# Altium schematic sheet 02 BLOCK DIAGRAM.SchDoc
size 513 x 386 mm
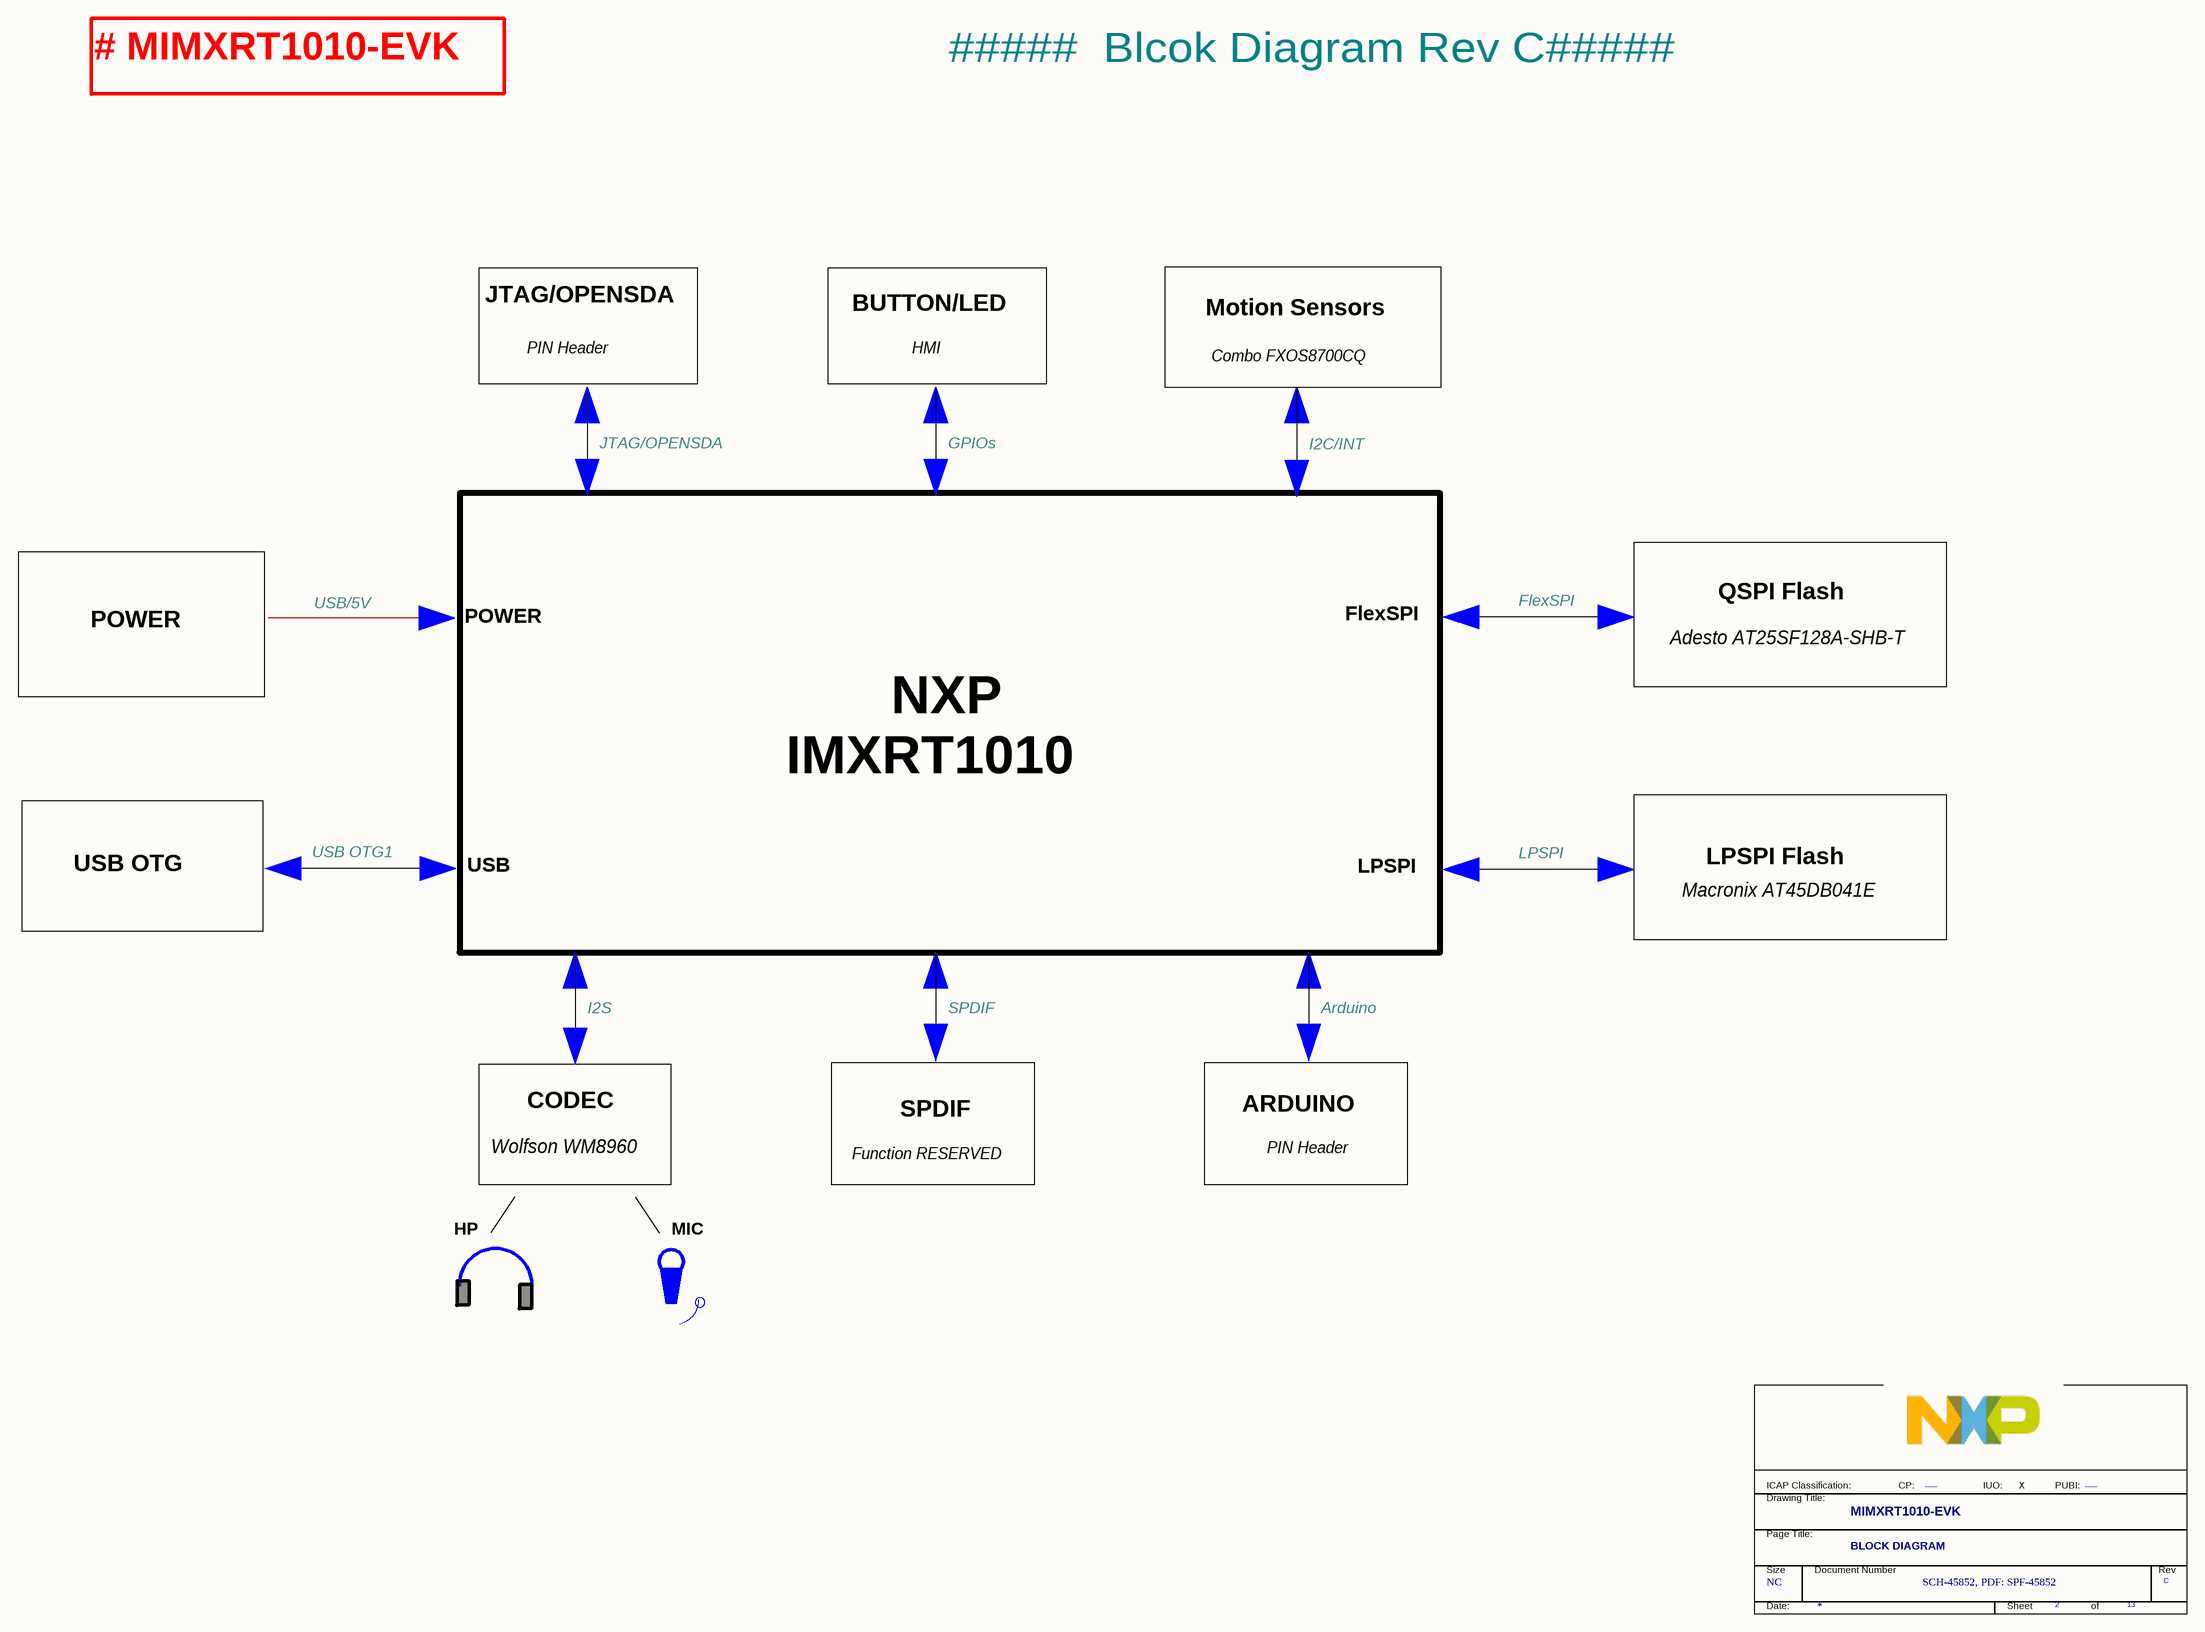
[diagram p0: 02 BLOCK DIAGRAM.SchDoc]

## Parts
*  PUBI: ___  Doc: SCH-45852, PDF: SPF-45852  RevCode: C  Title: MIMXRT1010-EVK  Page Size: NC  Page Number: 2  Page Count: 13  PageTitle: BLOCK DIAGRAM  (hidden comment: TitleBlock_FS)  (graphical)

## Notes on the sheet
- # MIMXRT1010-EVK
- #####  Blcok Diagram Rev C#####
- JTAG/OPENSDA
- BUTTON/LED
- Motion Sensors
- PIN Header
- HMI
- Combo FXOS8700CQ
- GPIOs
- I2C/INT
- USB/5V
- POWER
- FlexSPI
- QSPI Flash
- NXP
  IMXRT1010
- Adesto AT25SF128A-SHB-T
- USB OTG1
- LPSPI
- LPSPI Flash
- USB OTG
- USB
- Macronix AT45DB041E
- I2S
- SPDIF
- Arduino
- Wolfson WM8960
- CODEC
- Function RESERVED
- ARDUINO
- HP
- MIC
- X
- (in symbol TitleBlock_FS) ICAP Classification:; CP:; IUO:; PUBI:; Drawing Title:; Page Title:; Size; Document Number; Rev; Date:; Sheet; of

## Library data of the parts
* = TitleBlock_FS: FIUO: _X_; OrgAddr2: Austin, TX 78735-8598; OrgAddr1: 6501 William Cannon Drive West; OrgName: Freescale Semiconductor; FCP: ___; Page Create Date: March  8, 1995; Page Modify Date: *